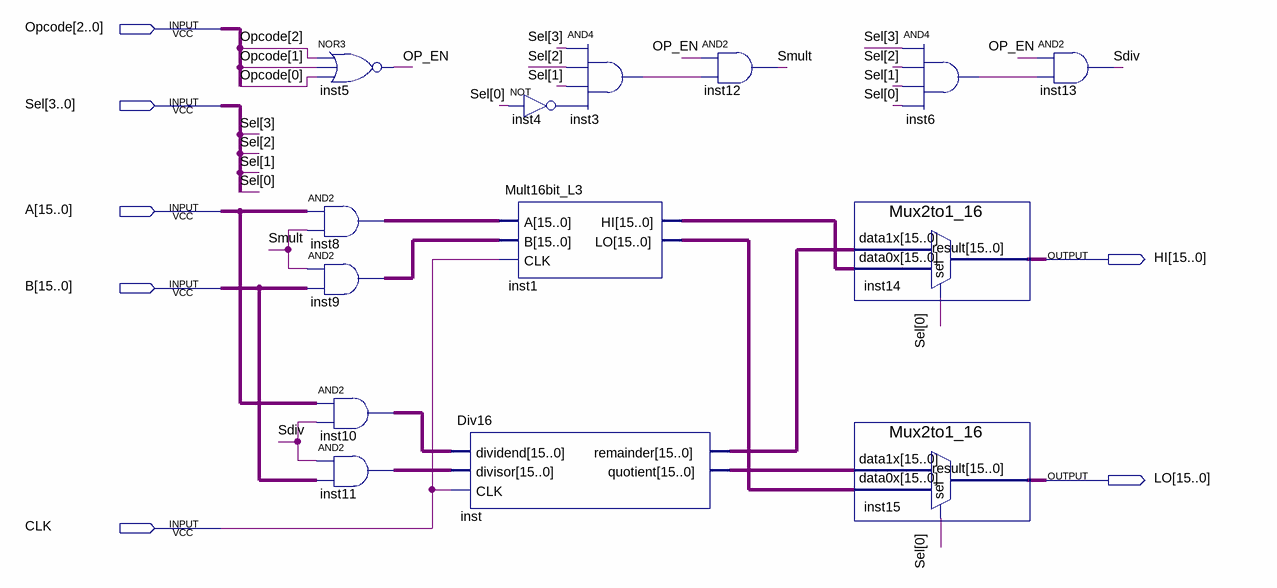
[diagram p0: schematic sheet]
// Quartus schematic MDU.bdf as structural Verilog: 14 symbols, 7 pins
module MDU (
  input  [2:0] Opcode,
  input  [3:0] Sel,
  input  [15:0] A,
  input  [15:0] B,
  input  CLK,
  output [15:0] HI,
  output [15:0] LO
);

  wire inst3_out, inst4_out, inst6_out, OP_EN, Sdiv, Smult;
  wire [15:0] inst1_hi, inst1_lo, inst8_out, inst9_out, inst10_out, inst11_out, inst_quotient, inst_remainder;

  nor inst5 (OP_EN, Opcode[2], Opcode[1], Opcode[0]);
  assign inst8_out = A & {16{Smult}};  // AND2 inst8, 16 bits wide
  assign inst9_out = {16{Smult}} & B;  // AND2 inst9, 16 bits wide
  assign inst10_out = A & {16{Sdiv}};  // AND2 inst10, 16 bits wide
  assign inst11_out = {16{Sdiv}} & B;  // AND2 inst11, 16 bits wide
  Mult16bit_L3 inst1 (.A(inst8_out), .B(inst9_out), .CLK(CLK), .HI(inst1_hi), .LO(inst1_lo));
  Div16 inst (
    .dividend(inst10_out), .divisor(inst11_out), .CLK(CLK), .remainder(inst_remainder),
    .quotient(inst_quotient));
  and inst3 (inst3_out, Sel[3], Sel[2], Sel[1], inst4_out);
  not inst4 (inst4_out, Sel[0]);
  and inst12 (Smult, OP_EN, inst3_out);
  Mux2to1_16 inst14 (.data1x(inst_remainder), .data0x(inst1_hi), .sel(Sel[0]), .result(HI));
  Mux2to1_16 inst15 (.data1x(inst_quotient), .data0x(inst1_lo), .sel(Sel[0]), .result(LO));
  and inst6 (inst6_out, Sel[3], Sel[2], Sel[1], Sel[0]);
  and inst13 (Sdiv, OP_EN, inst6_out);
endmodule
